# EasyEDA schematic SCH_MasterNodeV3_2024-03-10.json
TITLE: Sheet_1; REV: 1.0; Date: 2023-03-15; Sheet: 1/1; Drawn By: zihong; Company: Your Company
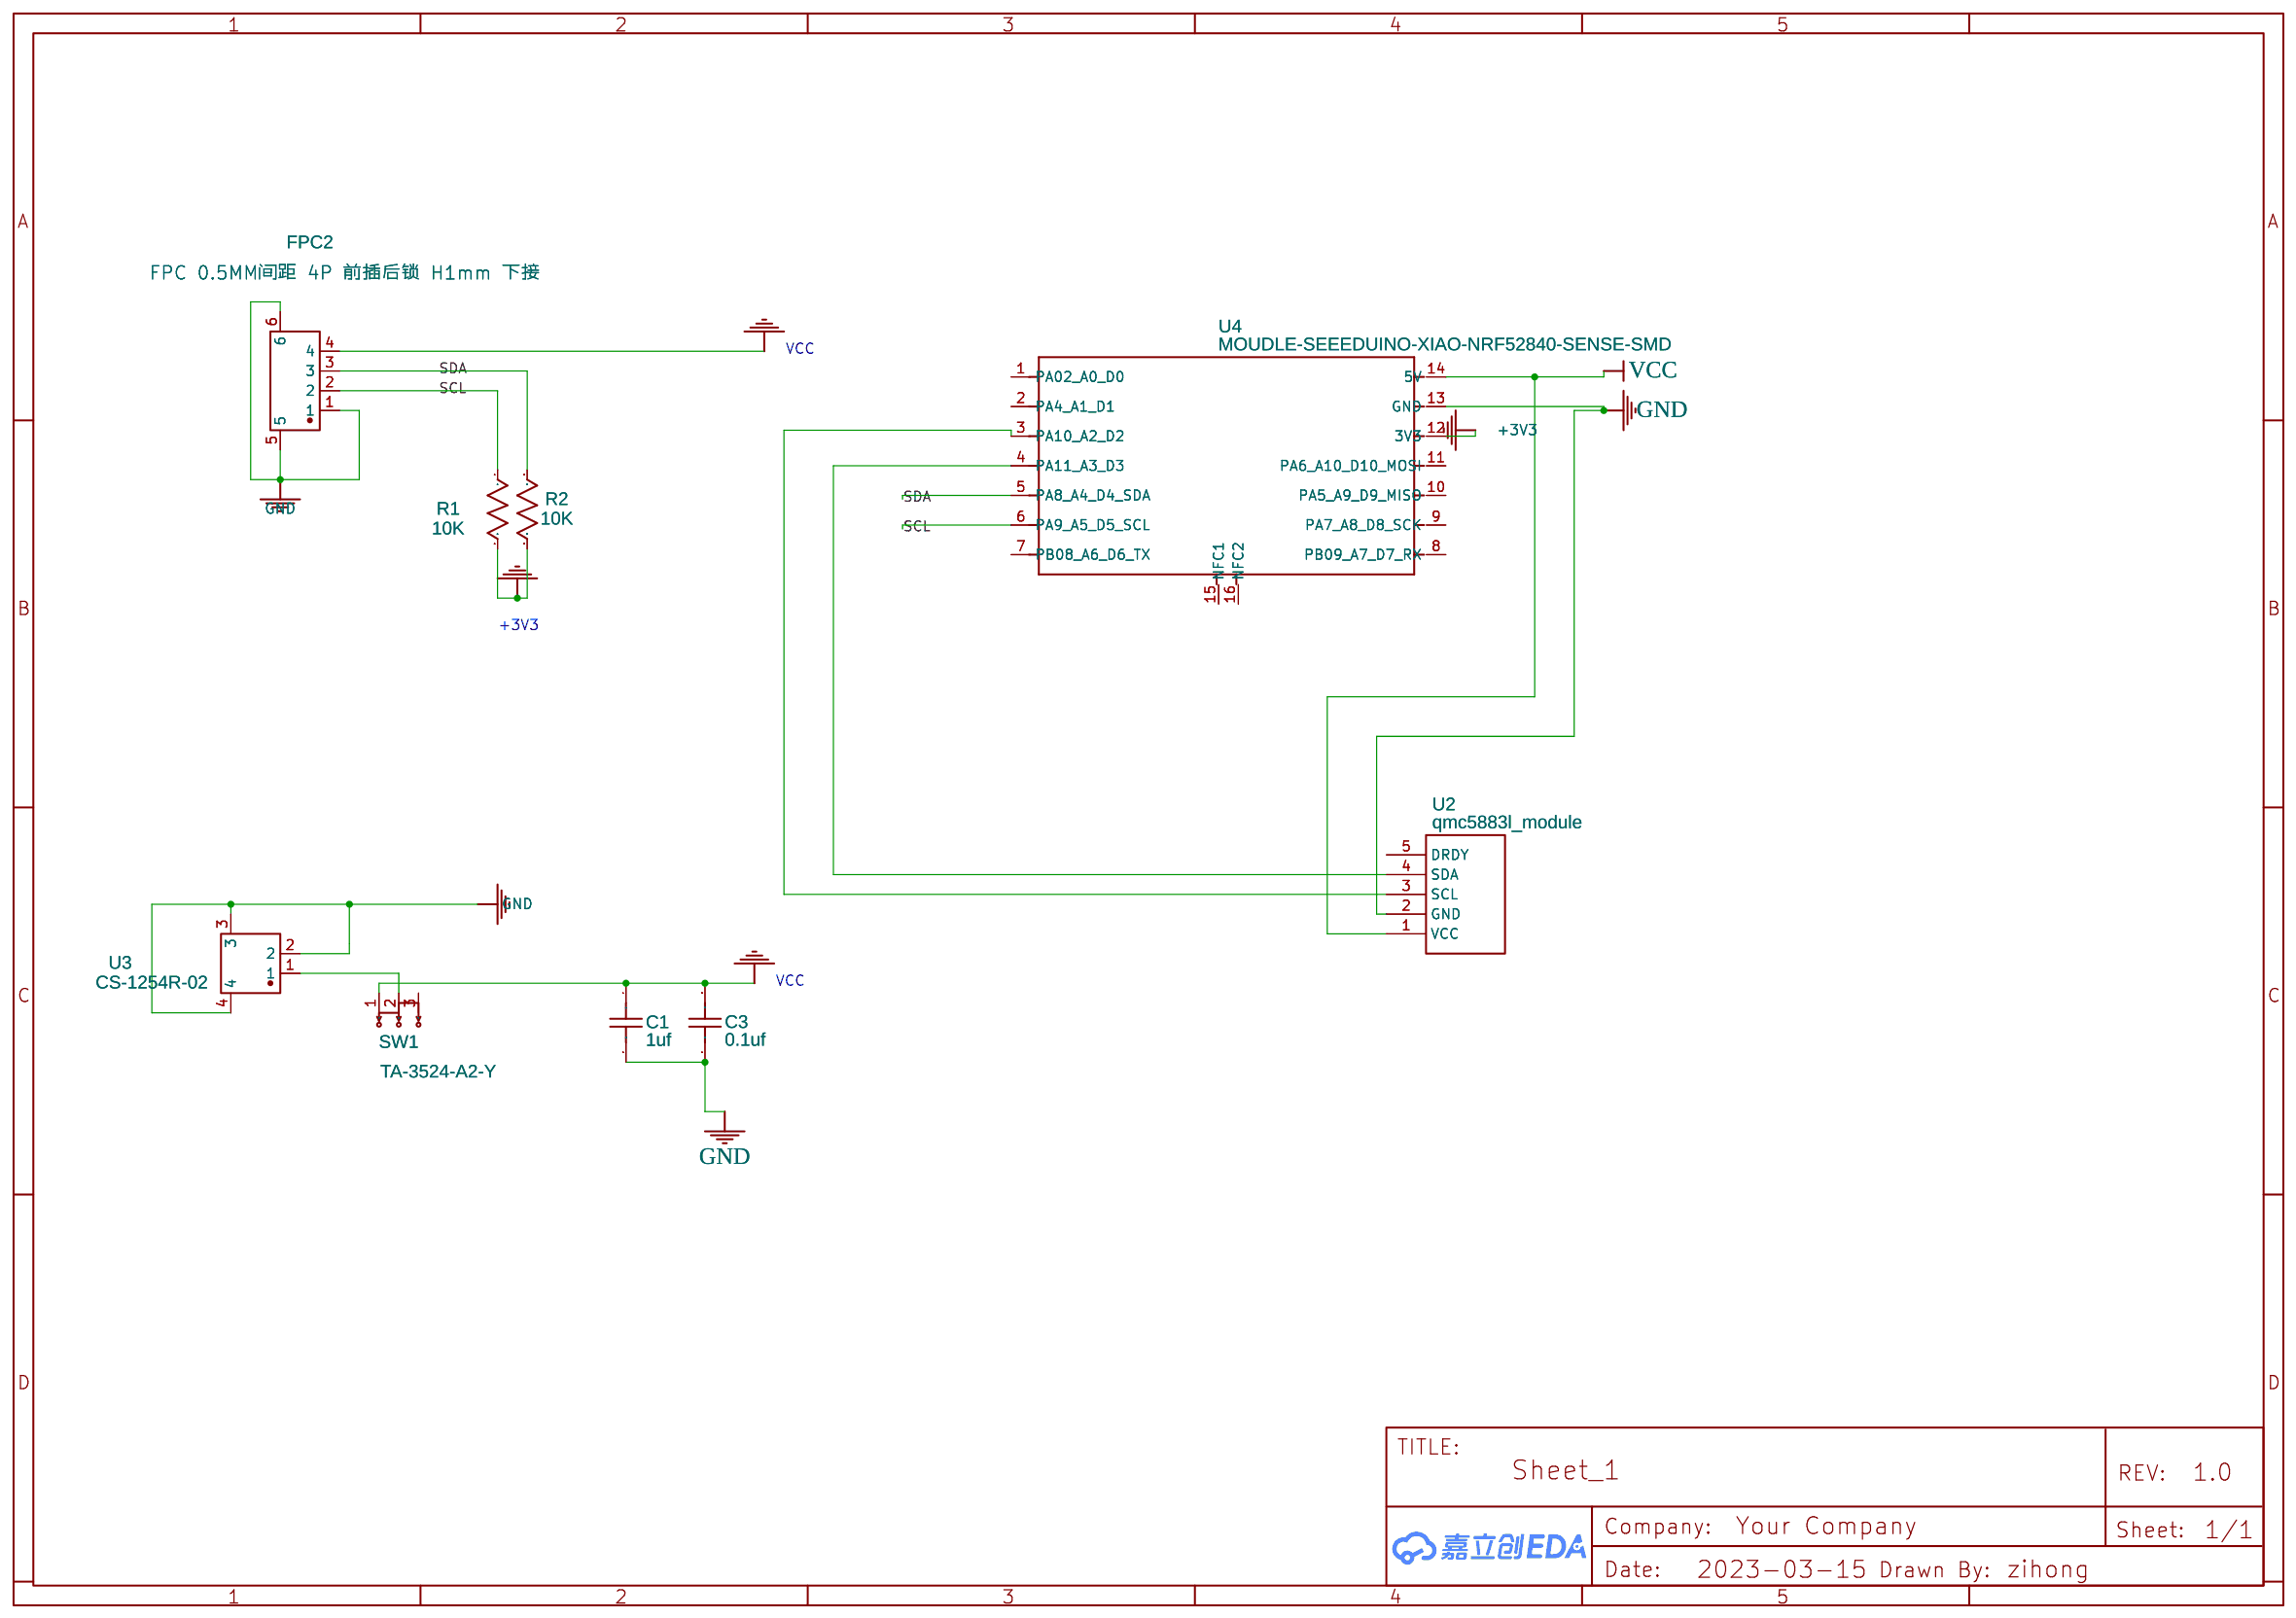
[diagram p0: schematic sheet]

## Parts
C1  1uf  [C0603K]
C3  0.1uf  [C0603K]
FPC2  FPC 0.5MM间距 4P 前插后锁 H1mm 下接  [FPC-0.5MM-4P-H1.0]
R1  10K  [R0603-S]
R2  10K  [R0603-S]
SW1  TA-3524-A2-Y  [SW-SMD_TA-3524-A2-Y]
U2  qmc5883l_module  [GY-271]
U3  CS-1254R-02  [CONN-SMD_2P-P1.00_CS-1254R-02]
U4  MOUDLE-SEEEDUINO-XIAO-NRF52840-SENSE-SMD  [MOUDLE16P-SMD-2.54-21X17.8MM]

## Library data of the parts
C1 C3 = C_0402_US: Contributor: LCEDA_Lib
FPC2 = FPC 0.5MM 4P 翻盖式 H2.0: Supplier: LCSC; Supplier Part: C9345; Manufacturer: ATOM(爱特姆); Contributor: LCSC; JLCPCB Part Class: Extended Part
R1 R2 = R_0402_US: Contributor: LCEDA_Lib
SW1 = TA-3524-A2-Y: Supplier: LCSC; Supplier Part: C842774; Manufacturer: Yuandi; Contributor: LCSC; JLCPCB Part Class: Extended Part
U2 = qmc5883l_module: Contributor: zihong
U3 = CS-1254R-02: Supplier: LCSC; Supplier Part: C5142894; Manufacturer: CST(永丰盈); link: https://atta.szlcsc.com/upload/public/pdf/source/20220830/B3A20729863F2D40D207DAE143922DD6.pdf; Contributor: lcsc
U4 = MOUDLE-SEEEDUINO-XIAO-NRF52840-SENSE-SMD: Contributor: zihong

## Nets
+3V3: R1.2 R2.2 U4.12(3V3)
GND: C1.2 C3.1 FPC2.1 FPC2.5 FPC2.6 U2.2(GND) U3.2 U3.3 U3.4 U4.13(GND)
VCC: C1.1 C3.2 FPC2.4 SW1.1 U2.1(VCC) U4.14(5V)
SCL: FPC2.2 R1.1 U4.6(PA9_A5_D5_SCL)
SDA: FPC2.3 R2.1 U4.5(PA8_A4_D4_SDA)
Net-(SW1-2): SW1.2 U3.1
Net-(U2-3): U2.3(SCL) U4.3(PA10_A2_D2)
Net-(U2-4): U2.4(SDA) U4.4(PA11_A3_D3)

Not connected (* = marked no-connect by the designer): SW1 3; U2 5(DRDY); U4 1(PA02_A0_D0) 2(PA4_A1_D1) 7(PB08_A6_D6_TX) 8(PB09_A7_D7_RX) 9(PA7_A8_D8_SCK) 10(PA5_A9_D9_MISO) 11(PA6_A10_D10_MOSI) 15(NFC1) 16(NFC2)
